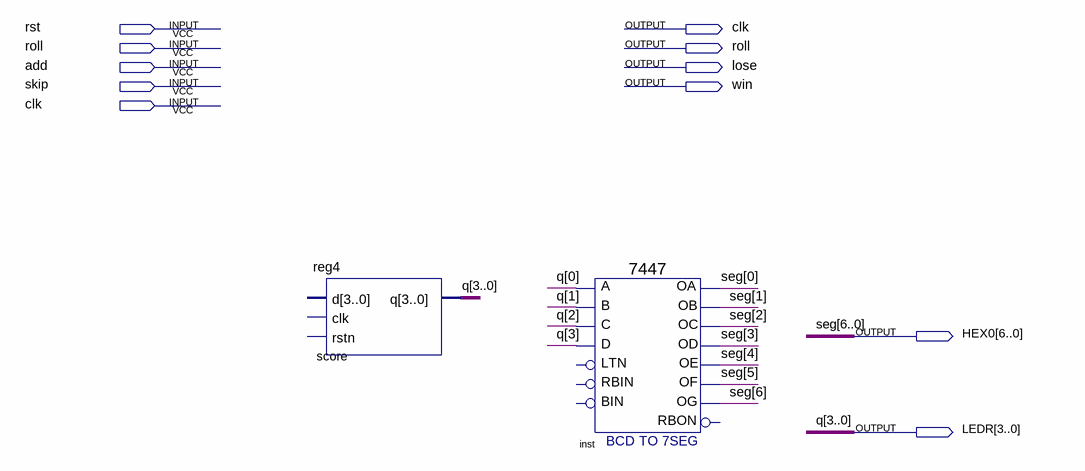
[diagram p0: schematic sheet]
// Quartus schematic state.bdf as structural Verilog: 2 symbols, 11 pins
module state (
  input  rst,
  inout  roll,
  input  add,
  input  skip,
  inout  clk,
  output lose,
  output win,
  output [6:0] HEX0,
  output [3:0] LEDR
);

  reg4 score (.q(LEDR));  // open: d, clk, rstn
  \7447  inst (
    .B(LEDR[1]), .C(LEDR[2]), .D(LEDR[3]), .A(LEDR[0]), .OB(HEX0[1]), .OC(HEX0[2]), .OE(HEX0[4]),
    .OD(HEX0[3]), .OF(HEX0[5]), .OG(HEX0[6]), .OA(HEX0[0]));  // open: LTN, RBIN, BIN, RBON

  // Other names for the same wires on the sheet: q[3:0] = LEDR; seg[6:0] = HEX0
endmodule
